# Altium project MPAXFC_00.PrjPcb (part 1 of 2)
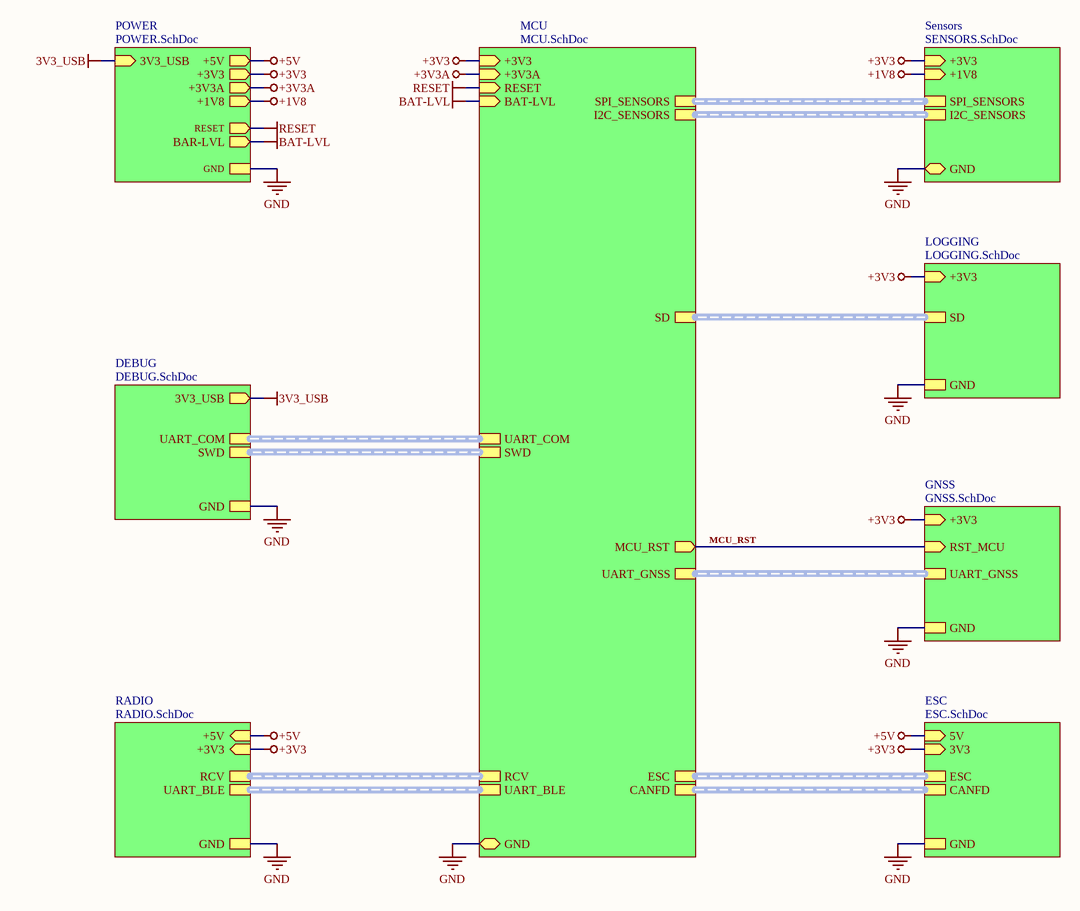
[diagram p0: MAIN.SchDoc]
9 sheets, 103 parts. Net scope: hierarchical (ports join the sheet entries above them; power ports are global).
Sheets:
  MAIN.SchDoc
    MCU = MCU.SchDoc
    Sensors = SENSORS.SchDoc
    LOGGING = LOGGING.SchDoc
    GNSS = GNSS.SchDoc
    POWER = POWER.SchDoc
    DEBUG = DEBUG.SchDoc
    ESC = ESC.SchDoc
    RADIO = RADIO.SchDoc

## Sheet MAIN.SchDoc
size A3

### Sub-sheets
DEBUG = DEBUG.SchDoc: GND, 3V3_USB (out), UART_COM (harness UART_COM), SWD (harness SWD)
ESC = ESC.SchDoc: 5V (in), 3V3 (in), GND, ESC (harness ESC), CANFD (harness CANFD)
GNSS = GNSS.SchDoc: +3V3 (in), GND, RST_MCU (in), UART_GNSS (harness UART_GNSS)
LOGGING = LOGGING.SchDoc: +3V3 (in), GND, SD (harness SD)
MCU = MCU.SchDoc: +3V3 (in), GND (bidir), +3V3A (in), RESET (in), SWD (harness SWD), UART_GNSS (harness UART_GNSS), UART_COM (harness UART_COM), RCV (harness RCV), ESC (harness ESC), CANFD (harness CANFD), SD (harness SD), SPI_SENSORS (harness SPI_SENSORS), I2C_SENSORS (harness I2C_SENSORS), BAT-LVL (in), MCU_RST (out), UART_BLE (harness UART_BLE)
POWER = POWER.SchDoc: +5V (out), +3V3 (out), +1V8 (out), GND, RESET (out), +3V3A (out), 3V3_USB (in), BAR-LVL (out)
RADIO = RADIO.SchDoc: +5V (in), +3V3 (in), GND, RCV (harness RCV), UART_BLE (harness UART_BLE)
Sensors = SENSORS.SchDoc: +3V3 (in), GND (bidir), +1V8 (in), SPI_SENSORS (harness SPI_SENSORS), I2C_SENSORS (harness I2C_SENSORS)

### Nets
3V3_USB: sheet POWER/3V3_USB, sheet DEBUG/3V3_USB  [project net +3V3_USB]
+1V8: sheet Sensors/+1V8, sheet POWER/+1V8
+3V3: sheet MCU/+3V3, sheet Sensors/+3V3, sheet LOGGING/+3V3, sheet GNSS/+3V3, sheet POWER/+3V3, sheet ESC/3V3, sheet RADIO/+3V3
+3V3A: sheet MCU/+3V3A, sheet POWER/+3V3A
+5V: sheet POWER/+5V, sheet ESC/5V, sheet RADIO/+5V
BAT-LVL: sheet MCU/BAT-LVL, sheet POWER/BAR-LVL  [project net ADC1_INP2]
GND: sheet MCU/GND, sheet Sensors/GND, sheet LOGGING/GND, sheet GNSS/GND, sheet POWER/GND, sheet DEBUG/GND, sheet ESC/GND, sheet RADIO/GND
MCU_RST: sheet MCU/MCU_RST, sheet GNSS/RST_MCU
RESET: sheet MCU/RESET, sheet POWER/RESET  [project net NRST]

### Buses and harness runs
harness sheet DEBUG/SWD = sheet MCU/SWD
harness sheet DEBUG/UART_COM = sheet MCU/UART_COM
harness sheet ESC/CANFD = sheet MCU/CANFD
harness sheet ESC/ESC = sheet MCU/ESC
harness sheet GNSS/UART_GNSS = sheet MCU/UART_GNSS
harness sheet LOGGING/SD = sheet MCU/SD
harness sheet MCU/I2C_SENSORS = sheet Sensors/I2C_SENSORS
harness sheet MCU/RCV = sheet RADIO/RCV
harness sheet MCU/SPI_SENSORS = sheet Sensors/SPI_SENSORS
harness sheet MCU/UART_BLE = sheet RADIO/UART_BLE

## Sheet MCU.SchDoc
size A3
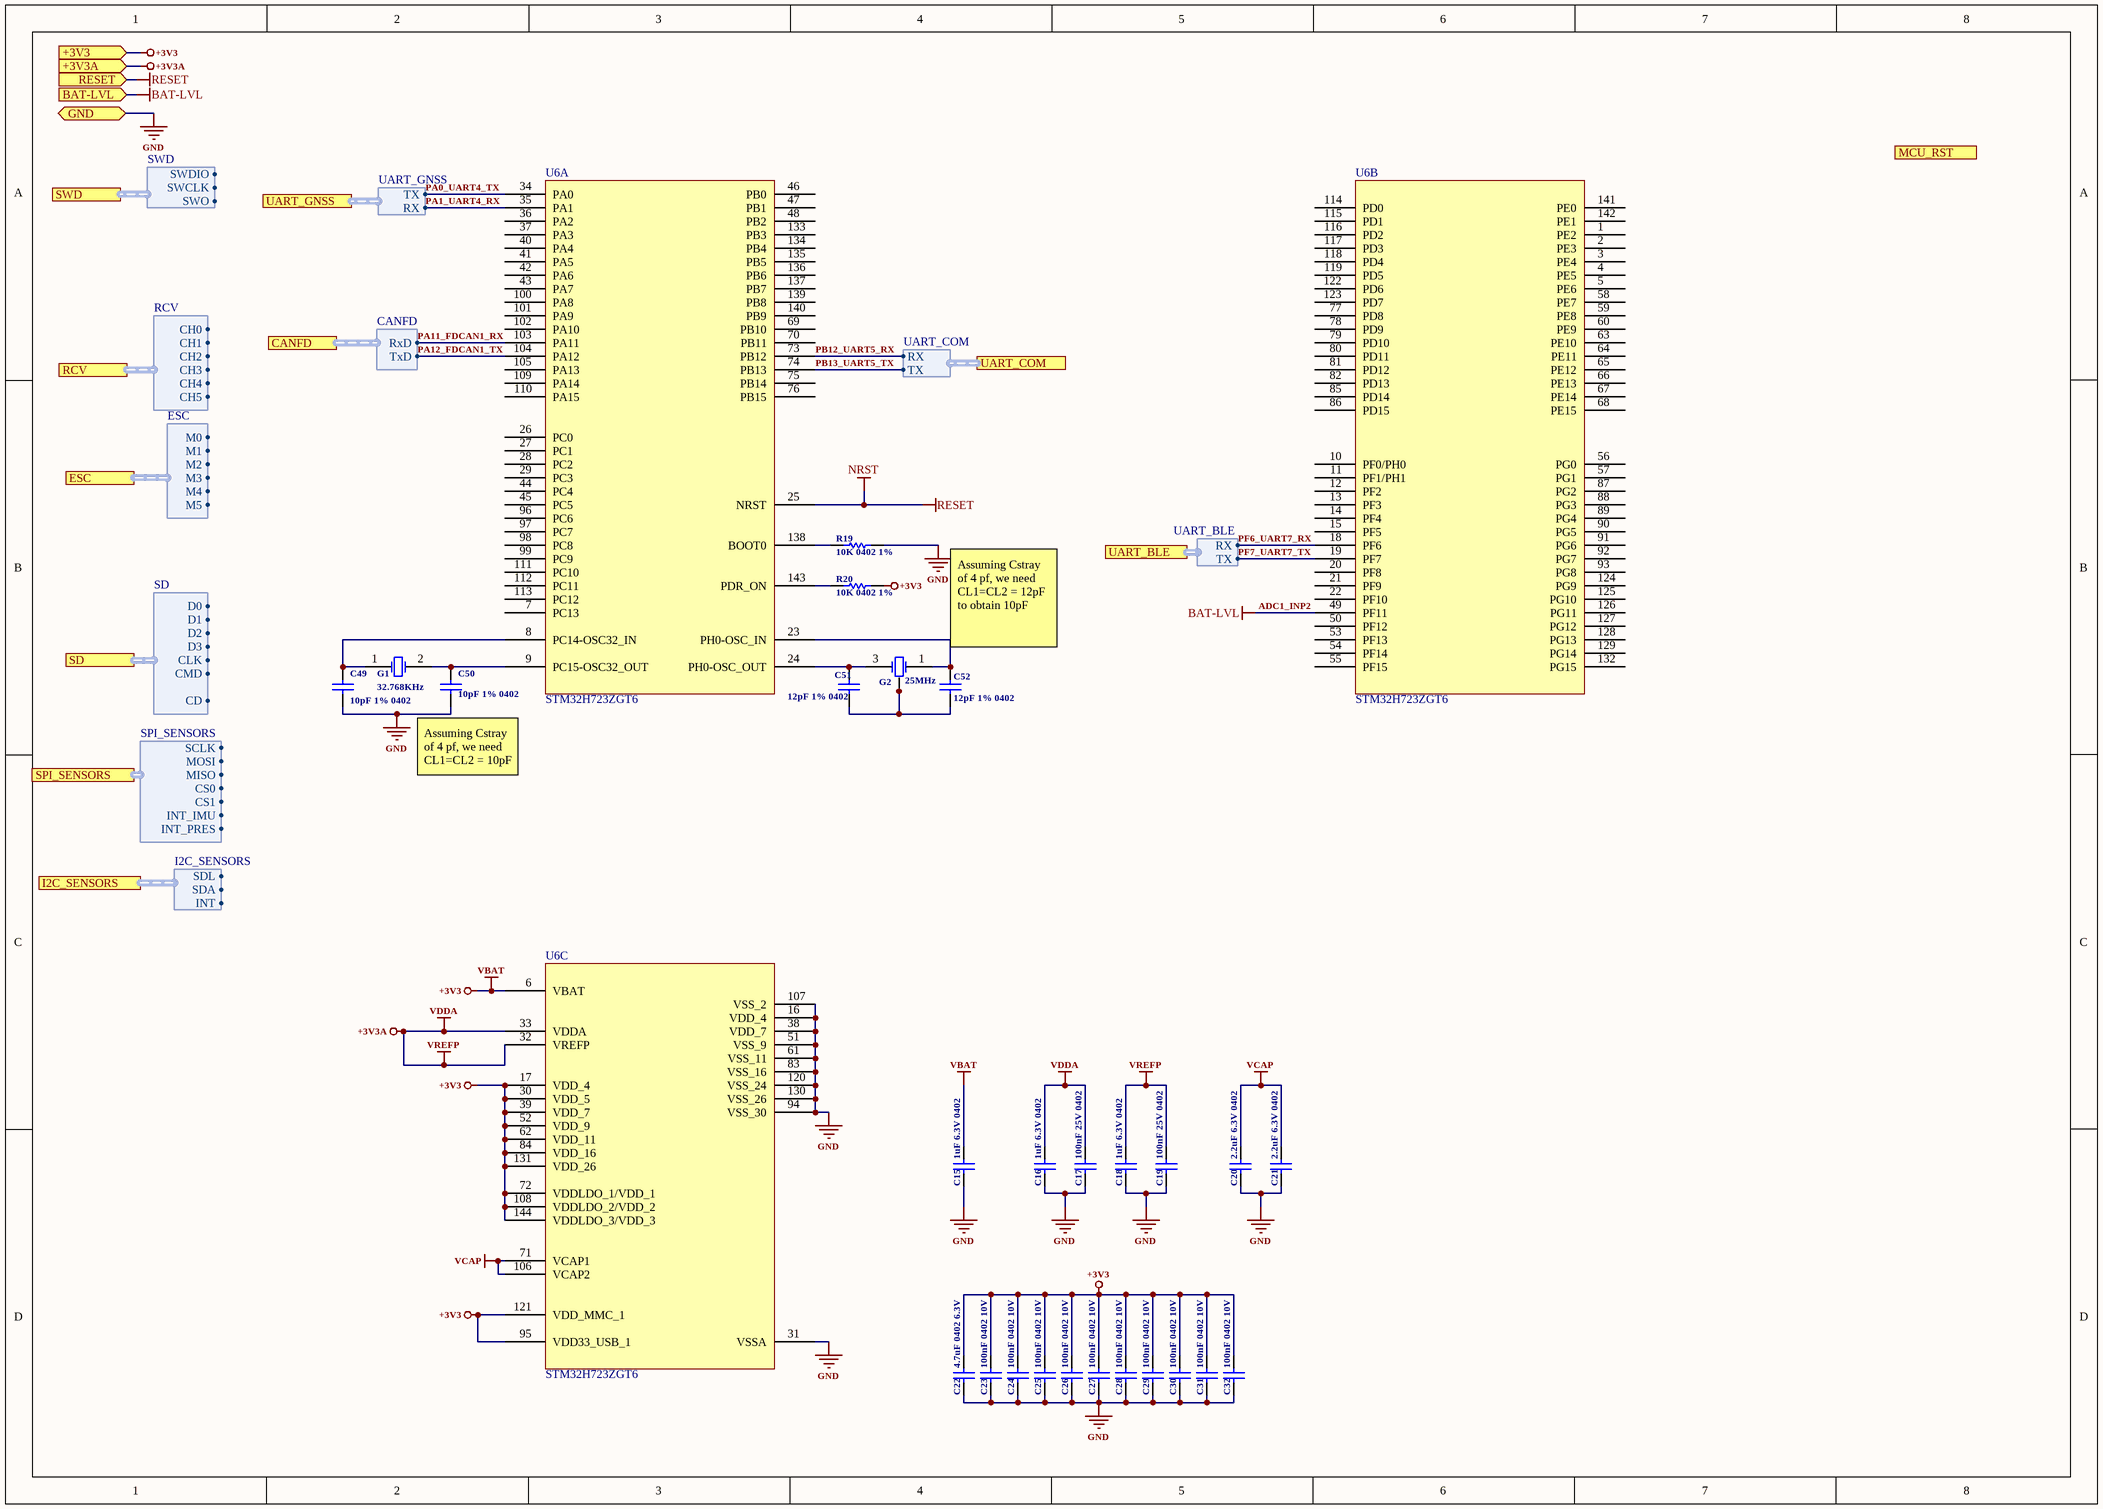
[diagram p1: MCU.SchDoc]

### Parts
C15  1uF 6.3V 0402
C16  1uF 6.3V 0402
C17  100nF 25V 0402
C18  1uF 6.3V 0402
C19  100nF 25V 0402
C20  2.2uF 6.3V 0402
C21  2.2uF 6.3V 0402
C22  4.7uF 0402 6.3V
C23  100nF 0402 10V
C24  100nF 0402 10V
C25  100nF 0402 10V
C26  100nF 0402 10V
C27  100nF 0402 10V
C28  100nF 0402 10V
C29  100nF 0402 10V
C30  100nF 0402 10V
C31  100nF 0402 10V
C32  100nF 0402 10V
C49  10pF 1% 0402
C50  10pF 1% 0402
C51  12pF 1% 0402
C52  12pF 1% 0402
G1  32.768KHz
G2  25MHz
R19  10K 0402 1%  [Resistor_0402]
R20  10K 0402 1%  [Resistor_0402]
U6  STM32H723ZGT6  (parts A,B,C of 3)

### Ports
+3V3 (in), +3V3A (in), BAT-LVL (in), CANFD (harness CANFD), ESC (harness ESC), GND (bidir), I2C_SENSORS (harness I2C_SENSORS), MCU_RST (out), RCV (harness RCV), RESET (in), SD (harness SD), SPI_SENSORS (harness SPI_SENSORS), SWD (harness SWD), UART_BLE (harness UART_BLE), UART_COM (harness UART_COM), UART_GNSS (harness UART_GNSS)

### Harnesses
SWD: SWDIO, SWCLK, SWO
UART_GNSS: TX, RX
UART_COM: TX, RX
RCV: CH0, CH1, CH2, CH3, CH4, CH5
ESC: M0, M1, M2, M3, M4, M5
CANFD: TxD, RxD
SD: CD, CMD, CLK, D0, D1, D2, D3
SPI_SENSORS: SCLK, MOSI, MISO, CS0, CS1, INT_IMU, INT_PRES
I2C_SENSORS: SDL, SDA, INT
UART_BLE: RX, TX

### Nets
+3V3: C15.2 C22.2 C23.2 C24.2 C25.2 C26.2 C27.2 C28.2 C29.2 C30.2 C31.2 C32.2 R20.2 U6.6(VBAT) U6.17(VDD_4) U6.30(VDD_5) U6.39(VDD_7) U6.52(VDD_9) U6.62(VDD_11) U6.72(VDDLDO_1/VDD_1) U6.84(VDD_16) U6.95(VDD33_USB_1) U6.108(VDDLDO_2/VDD_2) U6.121(VDD_MMC_1) U6.131(VDD_26) U6.144(VDDLDO_3/VDD_3) ; port +3V3  [also labelled VBAT]
+3V3A: C16.2 C17.2 C18.2 C19.2 U6.32(VREFP) U6.33(VDDA) ; port +3V3A  [also labelled VDDA, VREFP]
ADC1_INP2: U6.49(PF11) ; port BAT-LVL  [also labelled BAT-LVL]
GND: C15.1 C16.1 C17.1 C18.1 C19.1 C20.1 C21.1 C22.1 C23.1 C24.1 C25.1 C26.1 C27.1 C28.1 C29.1 C30.1 C31.1 C32.1 C49.1 C50.1 R19.2 U6.16(VDD_4) U6.31(VSSA) U6.38(VDD_7) U6.51(VSS_9) U6.61(VSS_11) U6.83(VSS_16) U6.94(VSS_30) U6.107(VSS_2) U6.120(VSS_24) U6.130(VSS_26) ; port GND
NRST: U6.25(NRST) ; port RESET  [also labelled RESET]
VCAP: C20.2 C21.2 U6.71(VCAP1) U6.106(VCAP2)
PA0_UART4_TX: U6.34(PA0) ; port UART_GNSS.TX
PA1_UART4_RX: U6.35(PA1) ; port UART_GNSS.RX
PA11_FDCAN1_RX: U6.103(PA11) ; port CANFD.RxD
PA12_FDCAN1_TX: U6.104(PA12) ; port CANFD.TxD
PB12_UART5_RX: U6.73(PB12) ; port UART_COM.RX
PB13_UART5_TX: U6.74(PB13) ; port UART_COM.TX
PF6_UART7_RX: U6.18(PF6) ; port UART_BLE.RX
PF7_UART7_TX: U6.19(PF7) ; port UART_BLE.TX
NetC49_2: C49.2 G1.1(OSC1) U6.8(PC14-OSC32_IN)
NetC50_2: C50.2 G1.2(OSC2) U6.9(PC15-OSC32_OUT)
NetC51_1: C51.1 C52.1 G2.2(GND) G2.4(GND)
NetC51_2: C51.2 G2.3(OSC1) U6.24(PH0-OSC_OUT)
NetC52_2: C52.2 G2.1(OSC2) U6.23(PH0-OSC_IN)
NetR19_1: R19.1 U6.138(BOOT0)
NetR20_1: R20.1 U6.143(PDR_ON)

Not connected (* = marked no-connect by the designer): U6 1(PE2) 2(PE3) 3(PE4) 4(PE5) 5(PE6) 7(PC13) 10(PF0/PH0) 11(PF1/PH1) 12(PF2) 13(PF3) 14(PF4) 15(PF5) 20(PF8) 21(PF9) 22(PF10) 26(PC0) 27(PC1) 28(PC2) 29(PC3) 36(PA2) 37(PA3) 40(PA4) 41(PA5) 42(PA6) 43(PA7) 44(PC4) 45(PC5) 46(PB0) 47(PB1) 48(PB2) 50(PF12) 53(PF13) 54(PF14) 55(PF15) 56(PG0) 57(PG1) 58(PE7) 59(PE8) 60(PE9) 63(PE10) 64(PE11) 65(PE12) 66(PE13) 67(PE14) 68(PE15) 69(PB10) 70(PB11) 75(PB14) 76(PB15) 77(PD8) 78(PD9) 79(PD10) 80(PD11) 81(PD12) 82(PD13) 85(PD14) 86(PD15) 87(PG2) 88(PG3) 89(PG4) 90(PG5) 91(PG6) 92(PG7) 93(PG8) 96(PC6) 97(PC7) 98(PC8) 99(PC9) 100(PA8) 101(PA9) 102(PA10) 105(PA13) 109(PA14) 110(PA15) 111(PC10) 112(PC11) 113(PC12) 114(PD0) 115(PD1) 116(PD2) 117(PD3) 118(PD4) 119(PD5) 122(PD6) 123(PD7) 124(PG9) 125(PG10) 126(PG11) 127(PG12) 128(PG13) 129(PG14) 132(PG15) 133(PB3) 134(PB4) 135(PB5) 136(PB6) 137(PB7) 139(PB8) 140(PB9) 141(PE0) 142(PE1)

### Notes on the sheet
- Assuming Cstray of 4 pf, we need CL1=CL2 = 12pF to obtain 10pF
- (near C50) Assuming Cstray of 4 pf, we need CL1=CL2 = 10pF

### Library data of the parts
C15 C16 C18 = CL05A105KQ5NNNC 1uF 0402: SAMSUNG ELECTRO-MECHANICS - CL05A105KQ5NNNC - SMD Multilayer Ceramic Capacitor, 1 µF, 6.3 V, 0402 [1005 Metric], ± 10%, X5R, CL Series; Capacitance: 1000000 pF; Supplier 1: Digi-Key; Manufacturer: Samsung; Manufacturer Part Number: CL05A105KQ5NNNC; Stock 1: 2633061; Pricing 1: 1=0.1, 10=0.019, 50=0.0106, 100=0.0087, 500=0.0062, 1000=0.0049, 2500=0.0044, 5000=0.0041 (USD); Case Size/Dimension: 0402; Dielectric: X5R; Tolerance (%): ±10 %; Rated Voltage: 6.3 V; ComponentLink1URL: http://www.samsungsem.com/kr/support/product-search/mlcc/CL05A105KQ5NNNC.jsp?src-supplier=Digi-Key; ComponentLink1Description: http://www.samsungsem.com/kr/support/product-search/mlcc/CL05A105KQ5NNNC.jsp?src-supplier=Digi-Key; ComponentLink2URL: http://www1.futureelectronics.com/doc/SAMSUNG%20PASSIVE/CL05B104KQ5NNNC.pdf?src-supplier=Future+Electronics; ComponentLink2Description: http://www1.futureelectronics.com/doc/SAMSUNG%20PASSIVE/CL05B104KQ5NNNC.pdf?src-supplier=Future+Electronics; ComponentLink3URL: https://www.verical.com/server-webapp/html/getDatasheet?partID=358391&src-supplier=Verical; ComponentLink3Description: https://www.verical.com/server-webapp/html/getDatasheet?partID=358391&src-supplier=Verical; ComponentLink4URL: https://produktinfo.conrad.com/datenblaetter/450000-474999/459172-da-01-en-VS_KONDENSATOR_0402.pdf?src-supplier=Conrad; ComponentLink4Description: https://produktinfo.conrad.com/datenblaetter/450000-474999/459172-da-01-en-VS_KONDENSATOR_0402.pdf?src-supplier=Conrad; Supplier Part Number 1: 1276-1010-1-ND; Value: 1uF 6.3V 0402
C17 C19 = CL05A104KA5NNNC 100nf 0402: 100nF, 25V, MLCC, 0402; Manufacturer: Samsung; Capacitance: 0.1 µF; Dielectric: X5R; Tolerance (%): ±10 %; Supplier 1: Digi-Key; Manufacturer Part Number: CL05A104KA5NNNC; Stock 1: 8000233; Pricing 1: 1=0.1, 10=0.012, 50=0.0064, 100=0.0053, 500=0.0038, 1000=0.003, 2500=0.0027, 5000=0.0025 (USD); Case Size/Dimension: 0402; Rated Voltage: 25 V; ComponentLink1URL: http://www1.futureelectronics.com/doc/SAMSUNG/CL05A104KA5NNNC.pdf?src-supplier=Future+Electronics; ComponentLink1Description: http://www1.futureelectronics.com/doc/SAMSUNG/CL05A104KA5NNNC.pdf?src-supplier=Future+Electronics; ComponentLink2URL: http://www.samsungsem.com/kr/support/product-search/mlcc/CL05A104KA5NNNC.jsp?src-supplier=Digi-Key; ComponentLink2Description: http://www.samsungsem.com/kr/support/product-search/mlcc/CL05A104KA5NNNC.jsp?src-supplier=Digi-Key; ComponentLink3URL: https://www.distrelec.biz/Web/Downloads/_e/ng/MLCC_CatalogDownload2013_ENG.pdf?mime=application%2Fpdf&src-supplier=Distrelec; ComponentLink3Description: https://www.distrelec.biz/Web/Downloads/_e/ng/MLCC_CatalogDownload2013_ENG.pdf?mime=application%2Fpdf&src-supplier=Distrelec; ComponentLink4URL: https://www.verical.com/server-webapp/html/getDatasheet?partID=357412&src-supplier=Verical; ComponentLink4Description: https://www.verical.com/server-webapp/html/getDatasheet?partID=357412&src-supplier=Verical; Supplier Part Number 1: 1276-1043-1-ND; Value: 100nF 25V 0402
C20 C21 = CL05A225MQ5NNNC 2.2uF 0402: CAP CER 2.2UF 6.3V X5R 0402; Designator: C?; Supplier 1: Digi-Key; Supplier Part Number 1: 1276-1469-1-ND; Value: 2.2uF 6.3V 0402
C22 = GRM155R60J475ME87D 4.7uF 0402 6.3V: MURATA - GRM155R60J475ME87D - SMD Multilayer Ceramic Capacitor, 4.7 µF, 6.3 V, 0402 [1005 Metric], ± 20%, X5R, GRM Series; Rad Hard: No; Product Depth: 0.5 mm; Voltage: 6.3 Vdc; Product Length: 1 mm; Supplier 1: Digi-Key; Manufacturer: Murata; Manufacturer Part Number: GRM155R60J475ME87D; Stock 1: 78795; Pricing 1: 1=0.14, 10=0.101, 50=0.0572, 100=0.0474, 500=0.0332, 1000=0.0275, 2500=0.0256, 5000=0.0234 (USD); Packaging: Tape & Reel; Package/Case: 0402; Mounting: Surface Mount; Capacitance Value: 4.7 uF; Tolerance: 20 %; Dielectric: X5R; Operating Temperature: -55 to 85 °C; Construction: Flat; Product Height: 0.5 mm; Category: Capacitor Ceramic Multilayer; ComponentLink1URL: https://www.murata.com/~/media/webrenewal/support/library/catalog/products/capacitor/mlcc/c02e.ashx?la=en-us&src-supplier=Digi-Key; ComponentLink1Description: https://www.murata.com/~/media/webrenewal/support/library/catalog/products/capacitor/mlcc/c02e.ashx?la=en-us&src-supplier=Digi-Key; ComponentLink2URL: http://components.arrow.com/part/dataview/47740841S8828489N2606?src-supplier=Arrow+Electronics; ComponentLink2Description: http://components.arrow.com/part/dataview/47740841S8828489N2606?src-supplier=Arrow+Electronics; Supplier Part Number 1: 490-5408-1-ND; Value: 4.7uF 0402 6.3V
C23-C32 = CL05A104KP5NNNC 100nF 0402 10V: Cap Ceramic 0.1uF 10V X5R 10% SMD 0402 85C Paper T/R; Manufacturer: Samsung; Capacitance: 100000 pF; Supplier 1: Digi-Key; Manufacturer Part Number: CL05A104KP5NNNC; Stock 1: 5595689; Pricing 1: 1=0.1, 10=0.021, 50=0.0116, 100=0.0094, 500=0.0067, 1000=0.0053, 2500=0.0048, 5000=0.0044 (USD); Case Size/Dimension: 0402; Dielectric: X5R; Tolerance (%): ±10 %; Rated Voltage: 10 V; ComponentLink1URL: https://www.distrelec.biz/Web/Downloads/_e/ng/MLCC_CatalogDownload2013_ENG.pdf?mime=application%2Fpdf&src-supplier=Distrelec; ComponentLink1Description: https://www.distrelec.biz/Web/Downloads/_e/ng/MLCC_CatalogDownload2013_ENG.pdf?mime=application%2Fpdf&src-supplier=Distrelec; ComponentLink2URL: https://media.digikey.com/pdf/Data%20Sheets/Samsung%20PDFs/CL_Series_MLCC_ds.pdf?src-supplier=Digi-Key; ComponentLink2Description: https://media.digikey.com/pdf/Data%20Sheets/Samsung%20PDFs/CL_Series_MLCC_ds.pdf?src-supplier=Digi-Key; ComponentLink3URL: http://www1.futureelectronics.com/doc/SAMSUNG%20PASSIVE/CL05B104KQ5NNNC.pdf?src-supplier=Future+Electronics; ComponentLink3Description: http://www1.futureelectronics.com/doc/SAMSUNG%20PASSIVE/CL05B104KQ5NNNC.pdf?src-supplier=Future+Electronics; ComponentLink4URL: https://www.verical.com/server-webapp/html/getDatasheet?partID=358611&src-supplier=Verical; ComponentLink4Description: https://www.verical.com/server-webapp/html/getDatasheet?partID=358611&src-supplier=Verical; Supplier Part Number 1: 1276-1022-1-ND; Value: 100nF 0402 10V
C49 C50 = CC0402FRNPO9BN100: 10 pF ±1% 50V Ceramic Capacitor C0G, NP0 0402 (1005 Metric); Supplier 1: Digi-Key; Supplier Part Number 1: 311-1640-1-ND; Value: 10pF 1% 0402
C51 C52 = CC0402FRNPO9BN120: 12 pF ±1% 50V Ceramic Capacitor C0G, NP0 0402 (1005 Metric); Supplier 1: Digi-Key; Supplier Part Number 1: 311-1641-1-ND; Value: 12pF 1% 0402
G1 = ECS-.327-9-34B-C-TR: 32.768 kHz ±10ppm Crystal 9pF 70 kOhms 2-SMD, No Lead; Value: 32.768KHz; Supplier 1: Digi-Key; Supplier Part Number 1: XC1949CT-ND
G2 = ECS-250-10-36B2-CTN-TR: 25 MHz ±10ppm Crystal 10pF 50 Ohms 4-SMD, No Lead; Supplier 1: Digi-Key; Supplier Part Number 1: 50-ECS-250-10-36B2-CTN-TRCT-ND; Value: 25MHz
R19 R20 = AC0402FR-0710KL 10K 0402 1%: RES SMD 10K OHM 1% 1/16W 0402; Manufacturer: Yageo; Resistance: 10 kOhms; Power Rating: 62.5 mW (1/16 W); Voltage Rating: 50 V; Temperature Coefficient: 100 PPM / C; Supplier 1: Digi-Key; Manufacturer Part Number: AC0402FR-0710KL; Stock 1: 1375478; Pricing 1: 1=0.1, 10=0.021, 100=0.0086, 1000=0.0039, 2500=0.0033, 5000=0.0028 (USD); Termination Style: SMD/SMT; Product: Thick Film Resistors SMD; Tolerance: 1 %; Case Code - in: 0402; Case Code - mm: 1005; Series: AC; Operating Temperature Range: - 55 C to + 155 C; Packaging: Reel; ComponentLink1URL: http://www.mouser.com/ds/2/447/yageodocoutput-1111992.pdf?src-supplier=Mouser; ComponentLink1Description: http://www.mouser.com/ds/2/447/yageodocoutput-1111992.pdf?src-supplier=Mouser; Supplier Part Number 1: YAG3436CT-ND; Value: 10K 0402 1%
U6 = STM32H723ZGT6: Supplier 1: Digi-Key; Supplier Part Number 1: 497-STM32H723ZGT6-ND

## Sheet SENSORS.SchDoc
size A4
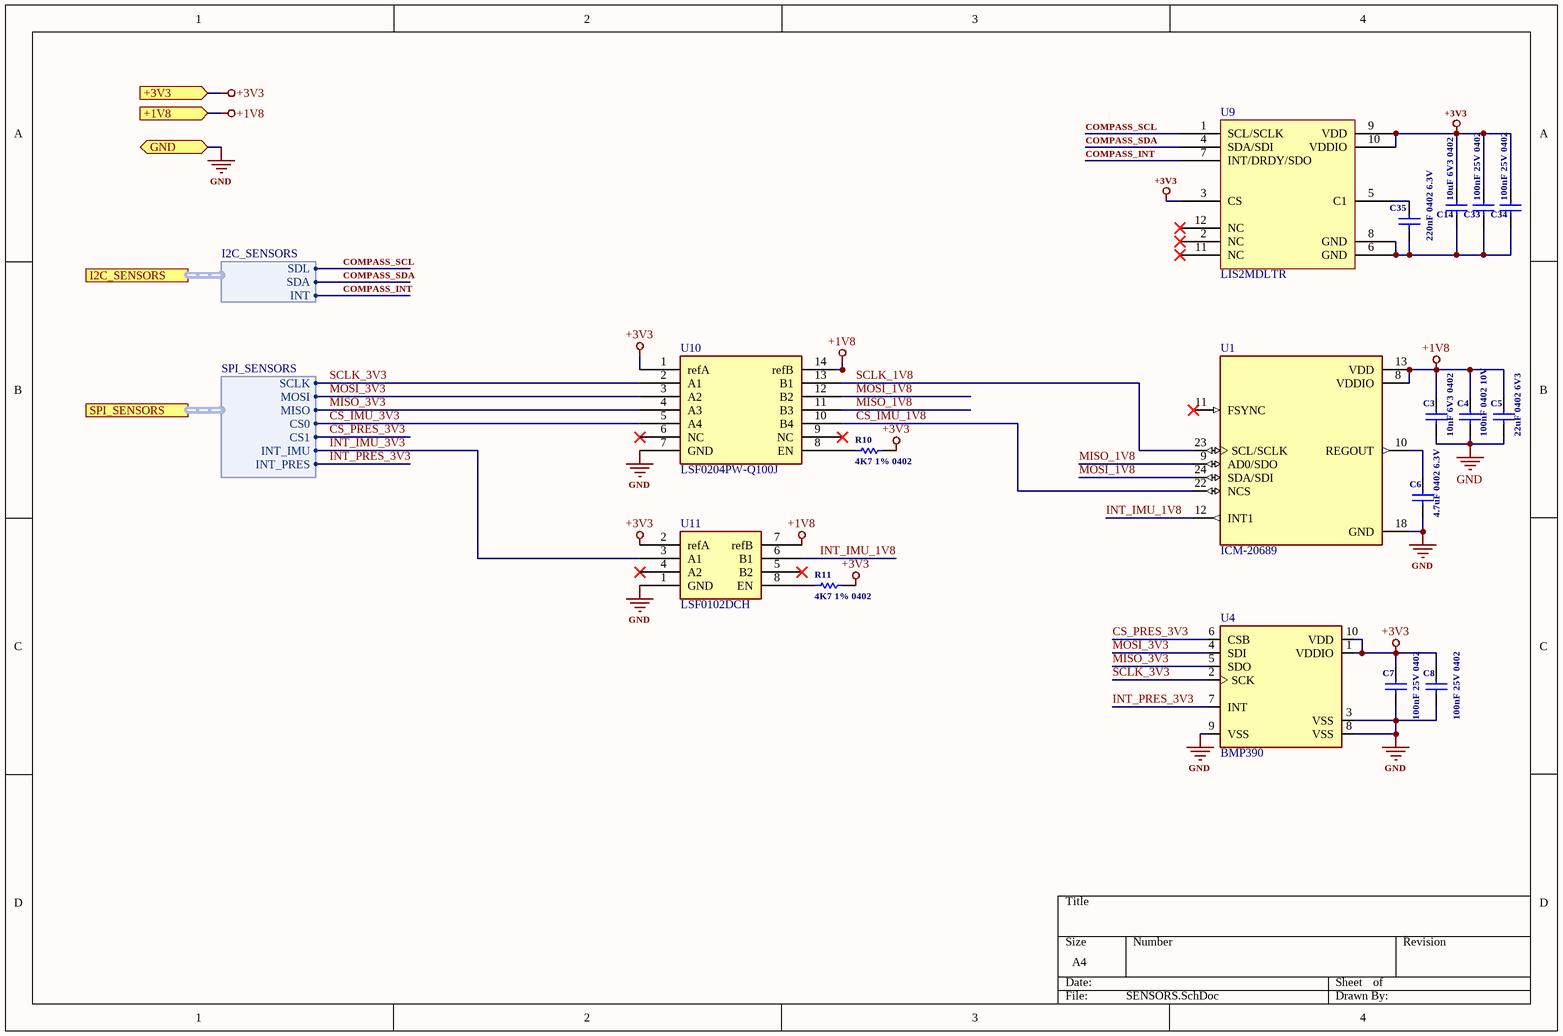
[diagram p2: SENSORS.SchDoc]

### Parts
C3  10nF 6V3 0402
C4  100nF 0402 10V
C5  22uF 0402 6V3
C6  4.7uF 0402 6.3V
C7  100nF 25V 0402
C8  100nF 25V 0402
C14  10uF 6V3 0402
C33  100nF 25V 0402
C34  100nF 25V 0402
C35  220nF 0402 6.3V
R10  4K7 1% 0402  [Resistor_0402]
R11  4K7 1% 0402  [Resistor_0402]
U1  ICM-20689
U4  BMP390
U9  LIS2MDLTR
U10  LSF0204PW-Q100J  [TSOP65P640X110-14N]
U11  LSF0102DCH

### Ports
+1V8 (in), +3V3 (in), GND (bidir), I2C_SENSORS (harness I2C_SENSORS), SPI_SENSORS (harness SPI_SENSORS)

### Harnesses
SPI_SENSORS: SCLK, MOSI, MISO, CS0, CS1, INT_IMU, INT_PRES
I2C_SENSORS: SDL, SDA, INT

### Nets
+1V8: C3.2 C4.2 C5.2 U1.8(VDDIO) U1.13(VDD) U10.14(refB) U11.7(refB) ; port +1V8
+3V3: C7.2 C8.2 C14.2 C33.2 C34.2 R10.2 R11.2 U4.1(VDDIO) U4.10(VDD) U9.3(CS) U9.9(VDD) U9.10(VDDIO) U10.1(refA) U11.2(refA) ; port +3V3
GND: C3.1 C4.1 C5.1 C6.1 C7.1 C8.1 U1.18(GND) U4.3(VSS) U4.8(VSS) U4.9(VSS) U10.7(GND) U11.1(GND) ; port GND
COMPASS_INT: U9.7(INT/DRDY/SDO) ; port I2C_SENSORS.INT
COMPASS_SCL: U9.1(SCL/SCLK) ; port I2C_SENSORS.SDL
COMPASS_SDA: U9.4(SDA/SDI) ; port I2C_SENSORS.SDA
CS_IMU_1V8: U1.22(NCS) U10.10(B4)
CS_IMU_3V3: U10.5(A4) ; port SPI_SENSORS.CS0
CS_PRES_3V3: U4.6(CSB) ; port SPI_SENSORS.CS1
INT_IMU_1V8: U1.12(INT1) U11.6(B1)
INT_IMU_3V3: U11.3(A1) ; port SPI_SENSORS.INT_IMU
INT_PRES_3V3: U4.7(INT) ; port SPI_SENSORS.INT_PRES
MISO_1V8: U1.9(AD0/SDO) U10.11(B3)
MISO_3V3: U4.5(SDO) U10.4(A3) ; port SPI_SENSORS.MISO
MOSI_1V8: U1.24(SDA/SDI) U10.12(B2)
MOSI_3V3: U4.4(SDI) U10.3(A2) ; port SPI_SENSORS.MOSI
SCLK_1V8: U1.23(SCL/SCLK) U10.13(B1)
SCLK_3V3: U4.2(SCK) U10.2(A1) ; port SPI_SENSORS.SCLK
NetC6_2: C6.2 U1.10(REGOUT)
NetC14_1: C14.1 C33.1 C34.1 C35.2 U9.6(GND) U9.8(GND)
NetC35_1: C35.1 U9.5(C1)
NetR10_1: R10.1 U10.8(EN)
NetR11_1: R11.1 U11.8(EN)

Not connected (* = marked no-connect by the designer): U1 11(FSYNC)*; U9 2(NC)* 11(NC)* 12(NC)*; U10 6(NC)* 9(NC)*; U11 4(A2)* 5(B2)*

### Library data of the parts
C3 = 04026C103KAT2A  10nF 6.3V: Supplier 1: Digi-Key; Supplier Part Number 1: 478-04026C103KAT2ACT-ND; Value: 10nF 6V3 0402
C4 = CL05A104KP5NNNC 100nF 0402 10V: as C23 on sheet MCU; Supplier 1: Digi-Key; Manufacturer Part Number: CL05A104KP5NNNC; Stock 1: 5595689; Pricing 1: 1=0.1, 10=0.021, 50=0.0116, 100=0.0094, 500=0.0067, 1000=0.0053, 2500=0.0048, 5000=0.0044 (USD); Case Size/Dimension: 0402; Dielectric: X5R; Tolerance (%): ±10 %; Rated Voltage: 10 V; ComponentLink1URL: https://www.distrelec.biz/Web/Downloads/_e/ng/MLCC_CatalogDownload2013_ENG.pdf?mime=application%2Fpdf&src-supplier=Distrelec; ComponentLink1Description: https://www.distrelec.biz/Web/Downloads/_e/ng/MLCC_CatalogDownload2013_ENG.pdf?mime=application%2Fpdf&src-supplier=Distrelec; ComponentLink2URL: https://media.digikey.com/pdf/Data%20Sheets/Samsung%20PDFs/CL_Series_MLCC_ds.pdf?src-supplier=Digi-Key; ComponentLink2Description: https://media.digikey.com/pdf/Data%20Sheets/Samsung%20PDFs/CL_Series_MLCC_ds.pdf?src-supplier=Digi-Key; ComponentLink3URL: http://www1.futureelectronics.com/doc/SAMSUNG%20PASSIVE/CL05B104KQ5NNNC.pdf?src-supplier=Future+Electronics; ComponentLink3Description: http://www1.futureelectronics.com/doc/SAMSUNG%20PASSIVE/CL05B104KQ5NNNC.pdf?src-supplier=Future+Electronics; ComponentLink4URL: https://www.verical.com/server-webapp/html/getDatasheet?partID=358611&src-supplier=Verical; ComponentLink4Description: https://www.verical.com/server-webapp/html/getDatasheet?partID=358611&src-supplier=Verical; Supplier Part Number 1: 1276-1022-1-ND; Value: 100nF 0402 10V
C5 = CL05A226MQ5N6J8 22uF 0402 6V3: CL05 Series 22 uF 6.3 V ±20% Tolerance X5R SMT Multilayer Ceramic Capacitor; Manufacturer: Samsung; Categories: Capacitors; Capacitance: 22µF; Voltage - Rated: 6.3V; Supplier 1: Digi-Key; Manufacturer Part Number: CL05A226MQ5N6J8; Stock 1: 135434; Pricing 1: 1=0.53, 10=0.366, 50=0.2564, 100=0.2197, 500=0.1648, 1000=0.1392, 2500=0.1318 (USD); Series: CL; Packaging: Tape & Reel (TR); Part Status: Active; Tolerance: ±20%; Temperature Coefficient: X5R; Operating Temperature: -55°C ~ 85°C; Features: -; Ratings: -; Applications: General Purpose; Failure Rate: -; Mounting Type: Surface Mount, MLCC; Package / Case: 0402 (1005 Metric); Size / Dimension: 0.039 L x 0.020 W (1.00mm x 0.50mm); Height - Seated (Max): -; Thickness (Max): 0.030 (0.75mm); Lead Spacing: -; Lead Style: -; ComponentLink1URL: http://www.samsungsem.com/kr/support/library/product-catalog/mlcc.jsp?src-supplier=Digi-Key; ComponentLink1Description: http://www.samsungsem.com/kr/support/library/product-catalog/mlcc.jsp?src-supplier=Digi-Key; Supplier Part Number 1: 1276-7090-1-ND; Value: 22uF 0402 6V3
C6 = GRM155R60J475ME87D 4.7uF 0402 6.3V: as C22 on sheet MCU; Supplier 1: Digi-Key; Manufacturer: Murata; Manufacturer Part Number: GRM155R60J475ME87D; Stock 1: 78795; Pricing 1: 1=0.14, 10=0.101, 50=0.0572, 100=0.0474, 500=0.0332, 1000=0.0275, 2500=0.0256, 5000=0.0234 (USD); Packaging: Tape & Reel; Package/Case: 0402; Mounting: Surface Mount; Capacitance Value: 4.7 uF; Tolerance: 20 %; Dielectric: X5R; Operating Temperature: -55 to 85 °C; Construction: Flat; Product Height: 0.5 mm; Category: Capacitor Ceramic Multilayer; ComponentLink1URL: https://www.murata.com/~/media/webrenewal/support/library/catalog/products/capacitor/mlcc/c02e.ashx?la=en-us&src-supplier=Digi-Key; ComponentLink1Description: https://www.murata.com/~/media/webrenewal/support/library/catalog/products/capacitor/mlcc/c02e.ashx?la=en-us&src-supplier=Digi-Key; ComponentLink2URL: http://components.arrow.com/part/dataview/47740841S8828489N2606?src-supplier=Arrow+Electronics; ComponentLink2Description: http://components.arrow.com/part/dataview/47740841S8828489N2606?src-supplier=Arrow+Electronics; Supplier Part Number 1: 490-5408-1-ND; Value: 4.7uF 0402 6.3V
C7 C8 C33 C34 = CL05A104KA5NNNC 100nf 0402: as C17 on sheet MCU; Supplier 1: Digi-Key; Manufacturer Part Number: CL05A104KA5NNNC; Stock 1: 8000233; Pricing 1: 1=0.1, 10=0.012, 50=0.0064, 100=0.0053, 500=0.0038, 1000=0.003, 2500=0.0027, 5000=0.0025 (USD); Case Size/Dimension: 0402; Rated Voltage: 25 V; ComponentLink1URL: http://www1.futureelectronics.com/doc/SAMSUNG/CL05A104KA5NNNC.pdf?src-supplier=Future+Electronics; ComponentLink1Description: http://www1.futureelectronics.com/doc/SAMSUNG/CL05A104KA5NNNC.pdf?src-supplier=Future+Electronics; ComponentLink2URL: http://www.samsungsem.com/kr/support/product-search/mlcc/CL05A104KA5NNNC.jsp?src-supplier=Digi-Key; ComponentLink2Description: http://www.samsungsem.com/kr/support/product-search/mlcc/CL05A104KA5NNNC.jsp?src-supplier=Digi-Key; ComponentLink3URL: https://www.distrelec.biz/Web/Downloads/_e/ng/MLCC_CatalogDownload2013_ENG.pdf?mime=application%2Fpdf&src-supplier=Distrelec; ComponentLink3Description: https://www.distrelec.biz/Web/Downloads/_e/ng/MLCC_CatalogDownload2013_ENG.pdf?mime=application%2Fpdf&src-supplier=Distrelec; ComponentLink4URL: https://www.verical.com/server-webapp/html/getDatasheet?partID=357412&src-supplier=Verical; ComponentLink4Description: https://www.verical.com/server-webapp/html/getDatasheet?partID=357412&src-supplier=Verical; Supplier Part Number 1: 1276-1043-1-ND; Value: 100nF 25V 0402
C14 = CL05A106MP5NUNC 10uF 0402: CL05A106MP5NUNC CAP CER 10UF 10V X5R 0402; Value: 10uF 6V3 0402; Supplier 1: Digi-Key; Supplier Part Number 1: 1276-1450-1-ND
C35 = CL05B224KO5NNNC 220nF 0402 6.3V: SAMSUNG ELECTRO-MECHANICS - CL05B224KO5NNNC - SMD Multilayer Ceramic Capacitor, 0.22 µF, 16 V, 0402 [1005 Metric], ± 10%, X7R, CL Series; Rated Voltage: 16 V; Supplier 1: Digi-Key; Manufacturer: Samsung; Manufacturer Part Number: CL05B224KO5NNNC; Stock 1: 1886603; Pricing 1: 1=0.1, 10=0.033, 50=0.0182, 100=0.0149, 500=0.0106, 1000=0.0084, 2500=0.0076, 5000=0.007 (USD); Capacitance: 220 nF; Case Size/Dimension: 0402; Dielectric: X7R; Tolerance (%): ±10 %; ComponentLink1URL: http://www.samsungsem.com/kr/support/product-search/mlcc/CL05B224KO5NNNC.jsp?src-supplier=Digi-Key; ComponentLink1Description: http://www.samsungsem.com/kr/support/product-search/mlcc/CL05B224KO5NNNC.jsp?src-supplier=Digi-Key; ComponentLink2URL: http://www1.futureelectronics.com/doc/SAMSUNG/CL05B224KO5NNNC.pdf?src-supplier=Future+Electronics; ComponentLink2Description: http://www1.futureelectronics.com/doc/SAMSUNG/CL05B224KO5NNNC.pdf?src-supplier=Future+Electronics; ComponentLink3URL: https://www.verical.com/server-webapp/html/getDatasheet?partID=358459&src-supplier=Verical; ComponentLink3Description: https://www.verical.com/server-webapp/html/getDatasheet?partID=358459&src-supplier=Verical; Supplier Part Number 1: 1276-1176-1-ND; Value: 220nF 0402 6.3V
R10 R11 = AC0402FR-074K7L 4.7K 1% 0402: Thick Film Resistors 1/16W 4.7K ohm 1% AEC-Q200; Manufacturer: Yageo; Resistance: 4.7 kOhms; Power Rating: 62.5 mW (1/16 W); Temperature Coefficient: 100 PPM / C; Voltage Rating: 50 V; Unit Weight: 0.000023 oz; Supplier 1: Digi-Key; Manufacturer Part Number: AC0402FR-074K7L; Stock 1: 3; Pricing 1: 1=0.1, 10=0.021, 100=0.0086, 1000=0.0039, 2500=0.0033, 5000=0.0028 (USD); Product Category: Thick Film Resistors; RoHS: True; Tolerance: 1 %; Case Code - in: 0402; Case Code - mm: 1005; Operating Temperature Range: - 55 C to + 155 C; Series: AC; Brand: Yageo; Height: 0.32 mm; Length: 1 mm; Package / Case: 0402 (1005 metric); Packaging: Reel; Product: Thick Film Resistors SMD; Termination Style: SMD/SMT; Type: Chip Resistor Surface Mount; Width: 0.5 mm; ComponentLink1URL: http://www.mouser.com/ds/2/447/yageodocoutput-1111992.pdf?src-supplier=Mouser; ComponentLink1Description: http://www.mouser.com/ds/2/447/yageodocoutput-1111992.pdf?src-supplier=Mouser; ComponentLink2URL: http://www.yageo.com/documents/recent/PYu-AC_51_RoHS_L_2_revised.pdf?src-supplier=Future+Electronics; ComponentLink2Description: http://www.yageo.com/documents/recent/PYu-AC_51_RoHS_L_2_revised.pdf?src-supplier=Future+Electronics; ComponentLink3URL: http://www.yageo.com/NewPortal/yageodocoutput?fileName=/pdf/R-Chip/PYu-AC_51_RoHS_L_6.pdf&src-supplier=Digi-Key; ComponentLink3Description: http://www.yageo.com/NewPortal/yageodocoutput?fileName=/pdf/R-Chip/PYu-AC_51_RoHS_L_6.pdf&src-supplier=Digi-Key; Supplier Part Number 1: YAG3497CT-ND; Value: 4K7 1% 0402
U1 = ICM-20689: IMU ACCEL/GYRO/COMPI2C/SPI 24QFN; Supplier 1: Digi-Key; Supplier Part Number 1: 1428-1059-6-ND
U10 = LSF0204PW-Q100J: Nivel de voltaje Traductores Bidireccional 1 circuitos 4 canales 120MHz 14-TSSOP; Supplier 1: Digi-Key; Supplier Part Number 1: 1727-LSF0204PW-Q100JCT-ND
U11 = LSF0102DCH: Voltage Level Translator Bidirectional 1 Circuit 2 Channel 100MHz 8-VSSOP; Supplier 1: Digi-Key; Supplier Part Number 1: 1727-LSF0102DCHCT-ND
U4 = BMP390: Supplier 1: Mouser; Supplier Part Number 1: 262-BMP390
U9 = LIS2MDLTR: Supplier 1: Digi-Key; Supplier Part Number 1: 497-17588-1-ND

## Sheet LOGGING.SchDoc
size A4
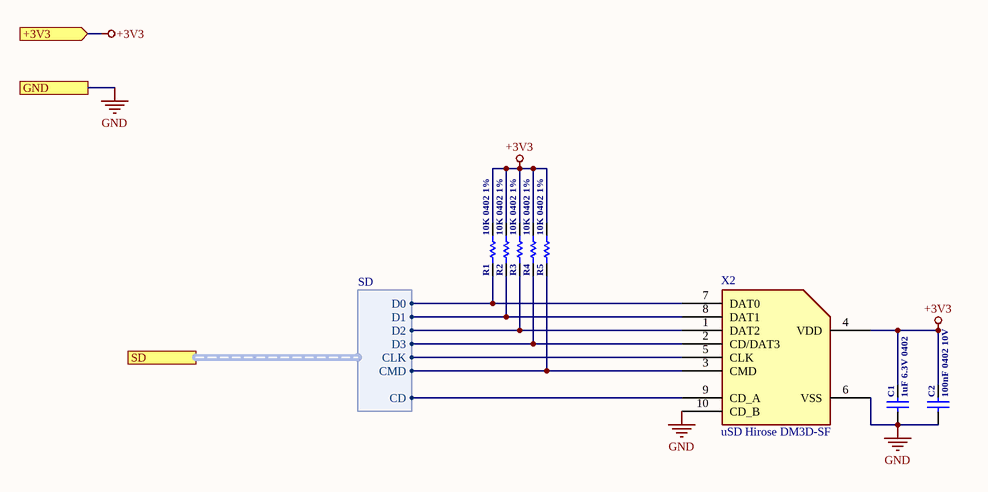
[diagram p3: LOGGING.SchDoc]

### Parts
C1  1uF 6.3V 0402
C2  100nF 0402 10V
R1  10K 0402 1%  [Resistor_0402]
R2  10K 0402 1%  [Resistor_0402]
R3  10K 0402 1%  [Resistor_0402]
R4  10K 0402 1%  [Resistor_0402]
R5  10K 0402 1%  [Resistor_0402]
X2  uSD Hirose DM3D-SF

### Ports
+3V3 (in), GND, SD (harness SD)

### Harnesses
SD: CD, CMD, CLK, D0, D1, D2, D3

### Nets
+3V3: C1.2 C2.2 R1.2 R2.2 R3.2 R4.2 R5.2 X2.4(VDD) ; port +3V3
GND: C1.1 C2.1 X2.6(VSS) X2.10(CD_B) ; port GND
NetR1_1: R1.1 X2.7(DAT0) ; port SD.D0
NetR2_1: R2.1 X2.8(DAT1) ; port SD.D1
NetR3_1: R3.1 X2.1(DAT2) ; port SD.D2
NetR4_1: R4.1 X2.2(CD/DAT3) ; port SD.D3
NetR5_1: R5.1 X2.3(CMD) ; port SD.CMD
NetX2_5: X2.5(CLK) ; port SD.CLK
NetX2_9: X2.9(CD_A) ; port SD.CD

### Library data of the parts
C1 = CL05A105KQ5NNNC 1uF 0402: as C15 on sheet MCU; Supplier 1: Digi-Key; Manufacturer: Samsung; Manufacturer Part Number: CL05A105KQ5NNNC; Stock 1: 2633061; Pricing 1: 1=0.1, 10=0.019, 50=0.0106, 100=0.0087, 500=0.0062, 1000=0.0049, 2500=0.0044, 5000=0.0041 (USD); Case Size/Dimension: 0402; Dielectric: X5R; Tolerance (%): ±10 %; Rated Voltage: 6.3 V; ComponentLink1URL: http://www.samsungsem.com/kr/support/product-search/mlcc/CL05A105KQ5NNNC.jsp?src-supplier=Digi-Key; ComponentLink1Description: http://www.samsungsem.com/kr/support/product-search/mlcc/CL05A105KQ5NNNC.jsp?src-supplier=Digi-Key; ComponentLink2URL: http://www1.futureelectronics.com/doc/SAMSUNG%20PASSIVE/CL05B104KQ5NNNC.pdf?src-supplier=Future+Electronics; ComponentLink2Description: http://www1.futureelectronics.com/doc/SAMSUNG%20PASSIVE/CL05B104KQ5NNNC.pdf?src-supplier=Future+Electronics; ComponentLink3URL: https://www.verical.com/server-webapp/html/getDatasheet?partID=358391&src-supplier=Verical; ComponentLink3Description: https://www.verical.com/server-webapp/html/getDatasheet?partID=358391&src-supplier=Verical; ComponentLink4URL: https://produktinfo.conrad.com/datenblaetter/450000-474999/459172-da-01-en-VS_KONDENSATOR_0402.pdf?src-supplier=Conrad; ComponentLink4Description: https://produktinfo.conrad.com/datenblaetter/450000-474999/459172-da-01-en-VS_KONDENSATOR_0402.pdf?src-supplier=Conrad; Supplier Part Number 1: 1276-1010-1-ND; Value: 1uF 6.3V 0402
C2 = CL05A104KP5NNNC 100nF 0402 10V: as C23 on sheet MCU; Supplier 1: Digi-Key; Manufacturer Part Number: CL05A104KP5NNNC; Stock 1: 5595689; Pricing 1: 1=0.1, 10=0.021, 50=0.0116, 100=0.0094, 500=0.0067, 1000=0.0053, 2500=0.0048, 5000=0.0044 (USD); Case Size/Dimension: 0402; Dielectric: X5R; Tolerance (%): ±10 %; Rated Voltage: 10 V; ComponentLink1URL: https://www.distrelec.biz/Web/Downloads/_e/ng/MLCC_CatalogDownload2013_ENG.pdf?mime=application%2Fpdf&src-supplier=Distrelec; ComponentLink1Description: https://www.distrelec.biz/Web/Downloads/_e/ng/MLCC_CatalogDownload2013_ENG.pdf?mime=application%2Fpdf&src-supplier=Distrelec; ComponentLink2URL: https://media.digikey.com/pdf/Data%20Sheets/Samsung%20PDFs/CL_Series_MLCC_ds.pdf?src-supplier=Digi-Key; ComponentLink2Description: https://media.digikey.com/pdf/Data%20Sheets/Samsung%20PDFs/CL_Series_MLCC_ds.pdf?src-supplier=Digi-Key; ComponentLink3URL: http://www1.futureelectronics.com/doc/SAMSUNG%20PASSIVE/CL05B104KQ5NNNC.pdf?src-supplier=Future+Electronics; ComponentLink3Description: http://www1.futureelectronics.com/doc/SAMSUNG%20PASSIVE/CL05B104KQ5NNNC.pdf?src-supplier=Future+Electronics; ComponentLink4URL: https://www.verical.com/server-webapp/html/getDatasheet?partID=358611&src-supplier=Verical; ComponentLink4Description: https://www.verical.com/server-webapp/html/getDatasheet?partID=358611&src-supplier=Verical; Supplier Part Number 1: 1276-1022-1-ND; Value: 100nF 0402 10V
R1-R5 = AC0402FR-0710KL 10K 0402 1%: as R19 on sheet MCU; Supplier 1: Digi-Key; Manufacturer Part Number: AC0402FR-0710KL; Stock 1: 1375478; Pricing 1: 1=0.1, 10=0.021, 100=0.0086, 1000=0.0039, 2500=0.0033, 5000=0.0028 (USD); Termination Style: SMD/SMT; Product: Thick Film Resistors SMD; Tolerance: 1 %; Case Code - in: 0402; Case Code - mm: 1005; Series: AC; Operating Temperature Range: - 55 C to + 155 C; Packaging: Reel; ComponentLink1URL: http://www.mouser.com/ds/2/447/yageodocoutput-1111992.pdf?src-supplier=Mouser; ComponentLink1Description: http://www.mouser.com/ds/2/447/yageodocoutput-1111992.pdf?src-supplier=Mouser; Supplier Part Number 1: YAG3436CT-ND; Value: 10K 0402 1%
X2 = DM3D-SF: HIROSE(HRS) - DM3D-SF - Memory Socket, microSD Series, Memory Socket, 8 Contacts, Copper Alloy, Gold Plated Contacts; Product Training Modules: DM3 Series microSD Card Sockets; Featured Product: dm3d-series; HTML Datasheet: DM3 Series microSD.html; Card Type: Secure Digital - microSD™; Number of Positions: 10 (8 + 2); Connector Type: Connector; Insertion, Removal Method: Push In, Pull Out; Online Catalog: DM3 Series; Other Names: HR1941CT; Supplier 1: Digi-Key; Manufacturer: Hirose; Manufacturer Part Number: DM3D-SF; Stock 1: 0; Pricing 1: 1=1.65, 10=1.495, 25=1.4032, 50=1.342, 100=1.281, 250=1.159, 500=1.0675, 1000=0.915 (USD); Catalog Drawings: DM3D-SF; Standard Package: 1; Category: Connectors, Interconnects; Family: Memory Connectors - PC Card Sockets; Series: DM3; Packaging: Cut Tape (CT); Ejector Side: -; Mounting Type: Surface Mount, Right Angle; Features: Switch; Height Above Board: 0.061" (1.55mm); Mounting Feature: Normal, Standard - Top; Contact Finish: Gold; Contact Finish Thickness: -; ComponentLink1URL: http://www.farnell.com/datasheets/1697167.pdf?src-supplier=Element14; ComponentLink1Description: http://www.farnell.com/datasheets/1697167.pdf?src-supplier=Element14; ComponentLink2URL: http://www.farnell.com/datasheets/1697167.pdf?src-supplier=Farnell; ComponentLink2Description: http://www.farnell.com/datasheets/1697167.pdf?src-supplier=Farnell; ComponentLink3URL: http://uk.rs-online.com/webdocs/0fd1/0900766b80fd13c1.pdf?src-supplier=RSComponents; ComponentLink3Description: http://uk.rs-online.com/webdocs/0fd1/0900766b80fd13c1.pdf?src-supplier=RSComponents; ComponentLink4URL: http://www.hirose.co.jp/cataloge_hp/e60900232.pdf?src-supplier=Avnet; ComponentLink4Description: http://www.hirose.co.jp/cataloge_hp/e60900232.pdf?src-supplier=Avnet; ComponentLink5URL: http://www.hirose.co.jp/cataloge_hp/e60900232.pdf?src-supplier=Future+Electronics; ComponentLink5Description: http://www.hirose.co.jp/cataloge_hp/e60900232.pdf?src-supplier=Future+Electronics; ComponentLink6URL: https://www.verical.com/server-webapp/html/getDatasheet?partID=432464&src-supplier=Verical; ComponentLink6Description: https://www.verical.com/server-webapp/html/getDatasheet?partID=432464&src-supplier=Verical; ComponentLink7URL: https://www.hirose.com/product/en/download_file/key_name/DM3/category/Catalog/doc_file_id/49662/?file_category_id=4&item_id=195&is_series=1&src-supplier=Digi-Key; ComponentLink7Description: https://www.hirose.com/product/en/download_file/key_name/DM3/category/Catalog/doc_file_id/49662/?file_category_id=4&item_id=195&is_series=1&src-supplier=Digi-Key; Supplier Part Number 1: HR1941CT-ND

## Sheet GNSS.SchDoc
size A4
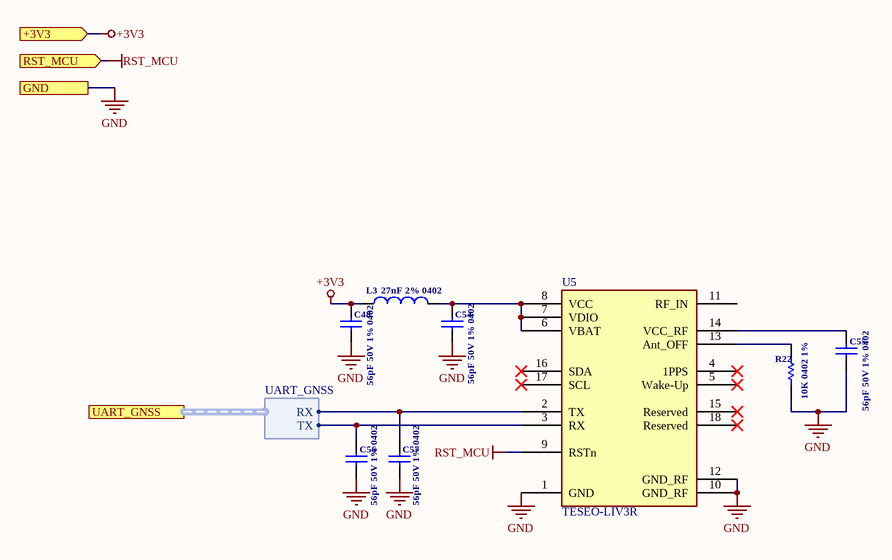
[diagram p4: GNSS.SchDoc]

### Parts
C48  56pF 50V 1% 0402
C54  56pF 50V 1% 0402
C55  56pF 50V 1% 0402
C56  56pF 50V 1% 0402
C57  56pF 50V 1% 0402
L3  27nF 2% 0402
R22  10K 0402 1%  [Resistor_0402]
U5  TESEO-LIV3R

### Ports
+3V3 (in), GND, RST_MCU (in), UART_GNSS (harness UART_GNSS)

### Harnesses
UART_GNSS: RX, TX

### Nets
+3V3: C48.2 L3.1 ; port +3V3
GND: C55.1 C56.1 C57.1 R22.1 U5.1(GND) U5.10(GND_RF) U5.12(GND_RF) ; port GND
RST_MCU: U5.9(RSTn) ; port RST_MCU  [project net MCU_RST]
PA0_UART4_TX: C56.2 U5.3(RX) ; port UART_GNSS.TX
PA1_UART4_RX: C57.2 U5.2(TX) ; port UART_GNSS.RX
NetC54_2: C54.2 L3.2 U5.6(VBAT) U5.7(VDIO) U5.8(VCC)
NetC55_2: C55.2 U5.14(VCC_RF)
NetR22_2: R22.2 U5.13(Ant_OFF)

Not connected (* = marked no-connect by the designer): C48 1; C54 1; U5 4(1PPS)* 5(Wake-Up)* 11(RF_IN) 15(Reserved)* 16(SDA)* 17(SCL)* 18(Reserved)*

### Notes on the sheet
- Labels drawn without touching a wire or pin: GND

### Library data of the parts
C48 C54-C57 = CC0402FRNPO9BN560: 56 pF ±1% 50V Ceramic Capacitor C0G, NP0 0402 (1005 Metric); Supplier 1: Digi-Key; Supplier Part Number 1: 311-3734-1-ND; Value: 56pF 50V 1% 0402
L3 = LQG15HS27NG02D: 27 nH Unshielded Multilayer Inductor 350 mA 460mOhm Max 0402 (1005 Metric) -; Supplier 1: Digi-Key; Value: 27nF 2% 0402; Supplier Part Number 1: 490-LQG15HS27NG02DCT-ND
R22 = AC0402FR-0710KL 10K 0402 1%: as R19 on sheet MCU; Supplier 1: Digi-Key; Manufacturer Part Number: AC0402FR-0710KL; Stock 1: 1375478; Pricing 1: 1=0.1, 10=0.021, 100=0.0086, 1000=0.0039, 2500=0.0033, 5000=0.0028 (USD); Termination Style: SMD/SMT; Product: Thick Film Resistors SMD; Tolerance: 1 %; Case Code - in: 0402; Case Code - mm: 1005; Series: AC; Operating Temperature Range: - 55 C to + 155 C; Packaging: Reel; ComponentLink1URL: http://www.mouser.com/ds/2/447/yageodocoutput-1111992.pdf?src-supplier=Mouser; ComponentLink1Description: http://www.mouser.com/ds/2/447/yageodocoutput-1111992.pdf?src-supplier=Mouser; Supplier Part Number 1: YAG3436CT-ND; Value: 10K 0402 1%
U5 = TESEO-LIV3R: series RF Receiver BeiDou, GLONASS, GNSS, GPS 1.561GHz, 1.575MHz -163dBm - - 18-LCC (9.7x10.1); Supplier 1: Digi-Key; Supplier Part Number 1: 497-19468-1-ND

## Sheet POWER.SchDoc
size A4
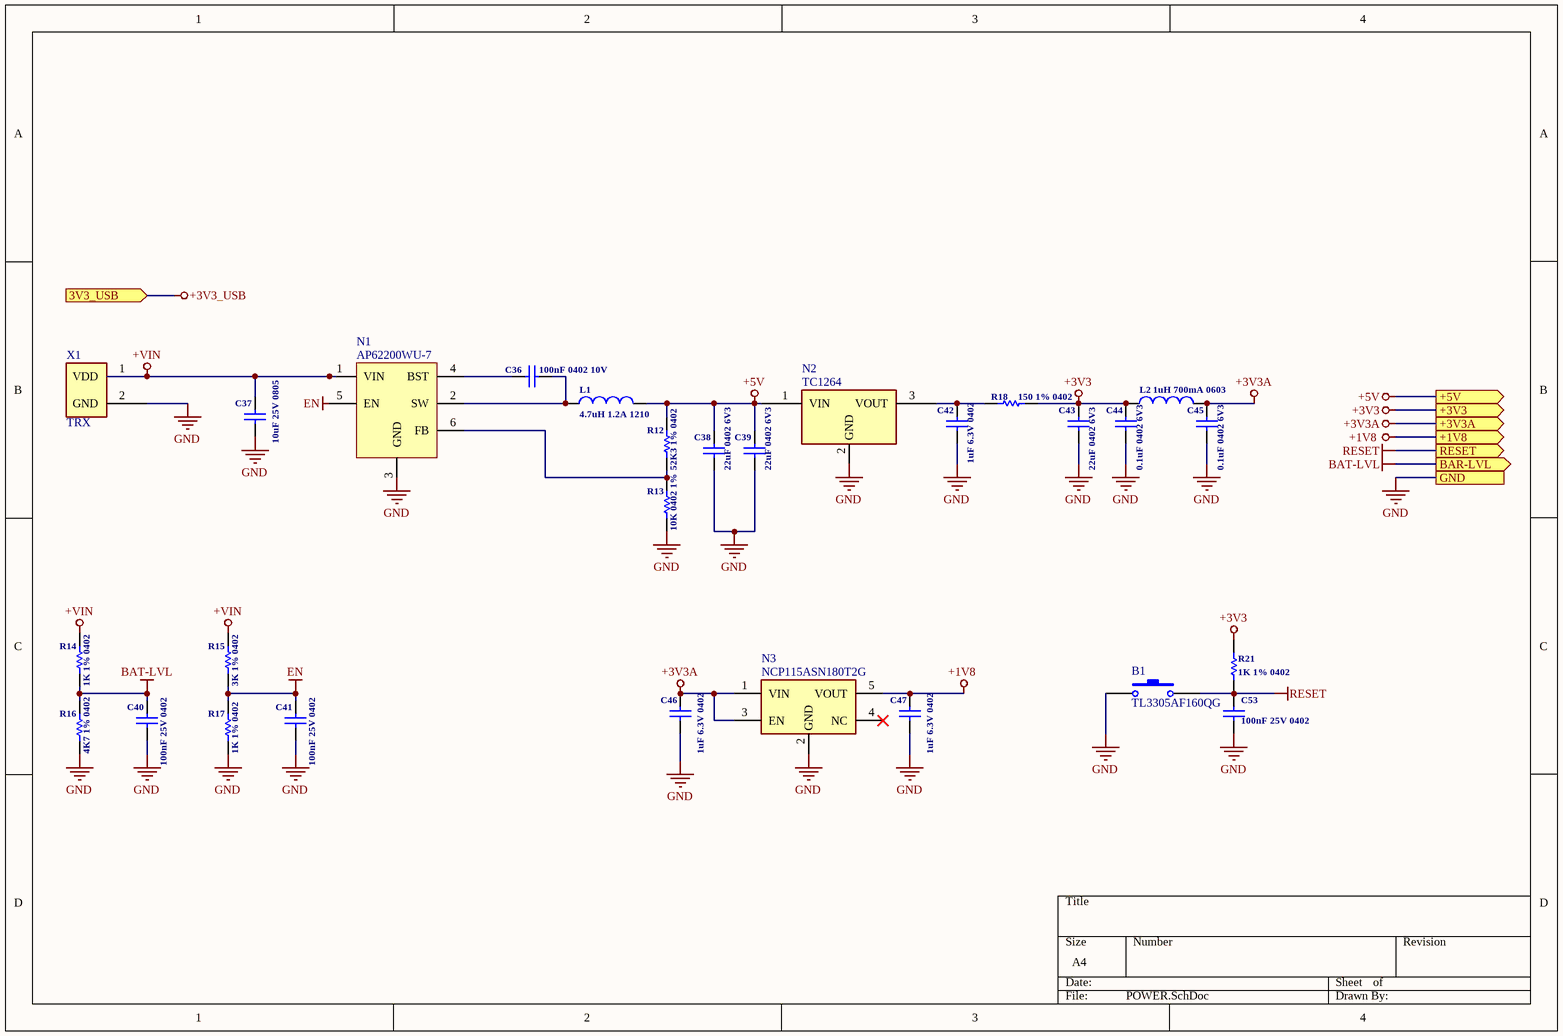
[diagram p5: POWER.SchDoc]

### Parts
B1  TL3305AF160QG
C36  100nF 0402 10V
C37  10uF 25V 0805
C38  22uF 0402 6V3
C39  22uF 0402 6V3
C40  100nF 25V 0402
C41  100nF 25V 0402
C42  1uF 6.3V 0402
C43  22uF 0402 6V3
C44  0.1uF 0402 6V3
C45  0.1uF 0402 6V3
C46  1uF 6.3V 0402
C47  1uF 6.3V 0402
C53  100nF 25V 0402
L1  4.7uH 1.2A 1210
L2  1uH 700mA 0603
N1  AP62200WU-7
N2  TC1264
N3  NCP115ASN180T2G  [NCP115ASN180T2G]
R12  52K3 1% 0402
R13  10K 0402 1%  [Resistor_0402]
R14  1K 1% 0402  [Resistor_0402]
R15  3K 1% 0402
R16  4K7 1% 0402  [Resistor_0402]
R17  1K 1% 0402  [Resistor_0402]
R18  150 1% 0402
R21  1K 1% 0402  [Resistor_0402]
X1  TRX

### Ports
3V3_USB (in), +1V8 (out), +3V3 (out), +3V3A (out), +5V (out), BAR-LVL (out), GND, RESET (out)

### Nets
+1V8 : C47.2 N3.5(VOUT) ; port +1V8  [project net +1V8]
+3V3: C43.2 C44.2 L2.1 R18.2 R21.2 ; port +3V3
+3V3A: C45.2 C46.2 L2.2 N3.1(VIN) N3.3(EN) ; port +3V3A
+5V: C38.2 C39.2 L1.2 N2.1(VIN) R12.2 ; port +5V
+VIN: C37.2 N1.1(VIN) R14.1 R15.2 X1.1(VDD)
BAT-LVL: C40.2 R14.2 R16.2 ; port BAR-LVL  [project net ADC1_INP2]
EN: C41.2 R15.1 R17.1
GND: B1.1 C37.1 C38.1 C39.1 C40.1 C41.1 C42.1 C43.1 C44.1 C45.1 C46.1 C47.1 C53.1 N1.3(GND) N2.2(GND) N3.2(GND) R13.1 R16.1 R17.2 X1.2(GND) ; port GND
RESET: B1.3 C53.2 R21.1 ; port RESET  [project net NRST]
NetC36_1: C36.1 L1.1 N1.2(SW)
NetC36_2: C36.2 N1.4(BST)
NetC42_2: C42.2 N2.3(VOUT) R18.1
NetN1_6: N1.6(FB) R12.1 R13.2

Not connected (* = marked no-connect by the designer): N1 5(EN); N3 4(NC)*

### Notes on the sheet
- Labels drawn without touching a wire or pin: EN

### Library data of the parts
B1 = TL3305AF160QG: Tactile Switch SPST-NO Top Actuated Surface Mount; Supplier 1: Digi-Key; Supplier Part Number 1: EG5350CT-ND
C36 = CL05A104KP5NNNC 100nF 0402 10V: as C23 on sheet MCU; Supplier 1: Digi-Key; Manufacturer Part Number: CL05A104KP5NNNC; Stock 1: 5595689; Pricing 1: 1=0.1, 10=0.021, 50=0.0116, 100=0.0094, 500=0.0067, 1000=0.0053, 2500=0.0048, 5000=0.0044 (USD); Case Size/Dimension: 0402; Dielectric: X5R; Tolerance (%): ±10 %; Rated Voltage: 10 V; ComponentLink1URL: https://www.distrelec.biz/Web/Downloads/_e/ng/MLCC_CatalogDownload2013_ENG.pdf?mime=application%2Fpdf&src-supplier=Distrelec; ComponentLink1Description: https://www.distrelec.biz/Web/Downloads/_e/ng/MLCC_CatalogDownload2013_ENG.pdf?mime=application%2Fpdf&src-supplier=Distrelec; ComponentLink2URL: https://media.digikey.com/pdf/Data%20Sheets/Samsung%20PDFs/CL_Series_MLCC_ds.pdf?src-supplier=Digi-Key; ComponentLink2Description: https://media.digikey.com/pdf/Data%20Sheets/Samsung%20PDFs/CL_Series_MLCC_ds.pdf?src-supplier=Digi-Key; ComponentLink3URL: http://www1.futureelectronics.com/doc/SAMSUNG%20PASSIVE/CL05B104KQ5NNNC.pdf?src-supplier=Future+Electronics; ComponentLink3Description: http://www1.futureelectronics.com/doc/SAMSUNG%20PASSIVE/CL05B104KQ5NNNC.pdf?src-supplier=Future+Electronics; ComponentLink4URL: https://www.verical.com/server-webapp/html/getDatasheet?partID=358611&src-supplier=Verical; ComponentLink4Description: https://www.verical.com/server-webapp/html/getDatasheet?partID=358611&src-supplier=Verical; Supplier Part Number 1: 1276-1022-1-ND; Value: 100nF 0402 10V
C37 = CL21A106KAYNNNG 10uF 0805: 10 µF ±10% 25V Ceramic Capacitor X5R 0805 (2012 Metric); Supplier 1: Digi-Key; Supplier Part Number 1: 1276-6454-1-ND; Value: 10uF 25V 0805
C38 C39 C43 = CL05A226MQ5N6J8 22uF 0402 6V3: as C5 on sheet SENSORS; Supplier 1: Digi-Key; Manufacturer Part Number: CL05A226MQ5N6J8; Stock 1: 135434; Pricing 1: 1=0.53, 10=0.366, 50=0.2564, 100=0.2197, 500=0.1648, 1000=0.1392, 2500=0.1318 (USD); Series: CL; Packaging: Tape & Reel (TR); Part Status: Active; Tolerance: ±20%; Temperature Coefficient: X5R; Operating Temperature: -55°C ~ 85°C; Features: -; Ratings: -; Applications: General Purpose; Failure Rate: -; Mounting Type: Surface Mount, MLCC; Package / Case: 0402 (1005 Metric); Size / Dimension: 0.039 L x 0.020 W (1.00mm x 0.50mm); Height - Seated (Max): -; Thickness (Max): 0.030 (0.75mm); Lead Spacing: -; Lead Style: -; ComponentLink1URL: http://www.samsungsem.com/kr/support/library/product-catalog/mlcc.jsp?src-supplier=Digi-Key; ComponentLink1Description: http://www.samsungsem.com/kr/support/library/product-catalog/mlcc.jsp?src-supplier=Digi-Key; Supplier Part Number 1: 1276-7090-1-ND; Value: 22uF 0402 6V3
C40 C41 C53 = CL05A104KA5NNNC 100nf 0402: as C17 on sheet MCU; Supplier 1: Digi-Key; Manufacturer Part Number: CL05A104KA5NNNC; Stock 1: 8000233; Pricing 1: 1=0.1, 10=0.012, 50=0.0064, 100=0.0053, 500=0.0038, 1000=0.003, 2500=0.0027, 5000=0.0025 (USD); Case Size/Dimension: 0402; Rated Voltage: 25 V; ComponentLink1URL: http://www1.futureelectronics.com/doc/SAMSUNG/CL05A104KA5NNNC.pdf?src-supplier=Future+Electronics; ComponentLink1Description: http://www1.futureelectronics.com/doc/SAMSUNG/CL05A104KA5NNNC.pdf?src-supplier=Future+Electronics; ComponentLink2URL: http://www.samsungsem.com/kr/support/product-search/mlcc/CL05A104KA5NNNC.jsp?src-supplier=Digi-Key; ComponentLink2Description: http://www.samsungsem.com/kr/support/product-search/mlcc/CL05A104KA5NNNC.jsp?src-supplier=Digi-Key; ComponentLink3URL: https://www.distrelec.biz/Web/Downloads/_e/ng/MLCC_CatalogDownload2013_ENG.pdf?mime=application%2Fpdf&src-supplier=Distrelec; ComponentLink3Description: https://www.distrelec.biz/Web/Downloads/_e/ng/MLCC_CatalogDownload2013_ENG.pdf?mime=application%2Fpdf&src-supplier=Distrelec; ComponentLink4URL: https://www.verical.com/server-webapp/html/getDatasheet?partID=357412&src-supplier=Verical; ComponentLink4Description: https://www.verical.com/server-webapp/html/getDatasheet?partID=357412&src-supplier=Verical; Supplier Part Number 1: 1276-1043-1-ND; Value: 100nF 25V 0402
C42 C46 C47 = CL05A105KQ5NNNC 1uF 0402: as C15 on sheet MCU; Supplier 1: Digi-Key; Manufacturer: Samsung; Manufacturer Part Number: CL05A105KQ5NNNC; Stock 1: 2633061; Pricing 1: 1=0.1, 10=0.019, 50=0.0106, 100=0.0087, 500=0.0062, 1000=0.0049, 2500=0.0044, 5000=0.0041 (USD); Case Size/Dimension: 0402; Dielectric: X5R; Tolerance (%): ±10 %; Rated Voltage: 6.3 V; ComponentLink1URL: http://www.samsungsem.com/kr/support/product-search/mlcc/CL05A105KQ5NNNC.jsp?src-supplier=Digi-Key; ComponentLink1Description: http://www.samsungsem.com/kr/support/product-search/mlcc/CL05A105KQ5NNNC.jsp?src-supplier=Digi-Key; ComponentLink2URL: http://www1.futureelectronics.com/doc/SAMSUNG%20PASSIVE/CL05B104KQ5NNNC.pdf?src-supplier=Future+Electronics; ComponentLink2Description: http://www1.futureelectronics.com/doc/SAMSUNG%20PASSIVE/CL05B104KQ5NNNC.pdf?src-supplier=Future+Electronics; ComponentLink3URL: https://www.verical.com/server-webapp/html/getDatasheet?partID=358391&src-supplier=Verical; ComponentLink3Description: https://www.verical.com/server-webapp/html/getDatasheet?partID=358391&src-supplier=Verical; ComponentLink4URL: https://produktinfo.conrad.com/datenblaetter/450000-474999/459172-da-01-en-VS_KONDENSATOR_0402.pdf?src-supplier=Conrad; ComponentLink4Description: https://produktinfo.conrad.com/datenblaetter/450000-474999/459172-da-01-en-VS_KONDENSATOR_0402.pdf?src-supplier=Conrad; Supplier Part Number 1: 1276-1010-1-ND; Value: 1uF 6.3V 0402
C44 C45 = CL05B104KQ5NNNC 0.1uF 0402 6V3: 0.1 µF ±10% 6.3V Ceramic Capacitor X7R 0402 (1005 Metric); Supplier 1: Digi-Key; Supplier Part Number 1: 1276-1511-1-ND; Value: 0.1uF 0402 6V3
L1 = 1276AS-H-4R7M=P2: 4.7 µH Shielded Wirewound Inductor 1.2 A 264mOhm Max 1210 (3225 Metric); Supplier 1: Digi-Key; Supplier Part Number 1: 490-10585-1-ND; Value: 4.7uH 1.2A 1210
L2 = MLZ1608N1R0LT000: 1 µH Shielded Multilayer Inductor 700 mA 110mOhm 0603 (1608 Metric); Supplier 1: Digi-Key; Supplier Part Number 1: 445-6753-1-ND; Value: 1uH 700mA 0603
N1 = AP62200WU-7: Buck Switching Regulator IC Positive Adjustable 0.8V 1 Output 2A SOT-23-6 Thin, TSOT-23-6; Supplier 1: Digi-Key; Supplier Part Number 1: 31-AP62200WU-7CT-ND
N2 = TC1264-3.3VDBTR: Linear Voltage Regulator IC Positive Fixed 1 Output 800mA SOT-223-3; Supplier 1: Digi-Key; Supplier Part Number 1: TC1264-3.3VDBCT-ND
R12 = RT0402FRE0752K3L 52K3 1% 0402: RES SMD 52.3K OHM 1% 1/16W 0402; Supplier 1: Digi-Key; Supplier Part Number 1: 13-RT0402FRE0752K3LCT-ND; Value: 52K3 1% 0402
R13 = AC0402FR-0710KL 10K 0402 1%: as R19 on sheet MCU; Supplier 1: Digi-Key; Manufacturer Part Number: AC0402FR-0710KL; Stock 1: 1375478; Pricing 1: 1=0.1, 10=0.021, 100=0.0086, 1000=0.0039, 2500=0.0033, 5000=0.0028 (USD); Termination Style: SMD/SMT; Product: Thick Film Resistors SMD; Tolerance: 1 %; Case Code - in: 0402; Case Code - mm: 1005; Series: AC; Operating Temperature Range: - 55 C to + 155 C; Packaging: Reel; ComponentLink1URL: http://www.mouser.com/ds/2/447/yageodocoutput-1111992.pdf?src-supplier=Mouser; ComponentLink1Description: http://www.mouser.com/ds/2/447/yageodocoutput-1111992.pdf?src-supplier=Mouser; Supplier Part Number 1: YAG3436CT-ND; Value: 10K 0402 1%
R14 R17 R21 = PFR05S-102-FNH 1K 1% 0402: Res SMD 1 Kohm 1% 1/16W 0402; Manufacturer: Cyntec; Supplier 1: Digi-Key; Manufacturer Part Number: PFR05S-102-FNH; Stock 1: 811154; Pricing 1: 1=0.1, 10=0.014, 100=0.0056, 1000=0.0025, 2500=0.0022, 5000=0.0018 (USD); Supplier Part Number 1: 2037-PFR05S-102-FNHCT-ND; Value: 1K 1% 0402
R15 = RMCF0402FT3K00 3K 0402 1%: 3 kOhms ±1% 0.063W, 1/16W Chip Resistor 0402 (1005 Metric) Automotive AEC-Q200 Thick Film; Supplier 1: Digi-Key; Supplier Part Number 1: RMCF0402FT3K00CT-ND; Value: 3K 1% 0402
R16 = AC0402FR-074K7L 4.7K 1% 0402: as R10 on sheet SENSORS; Supplier 1: Digi-Key; Manufacturer Part Number: AC0402FR-074K7L; Stock 1: 3; Pricing 1: 1=0.1, 10=0.021, 100=0.0086, 1000=0.0039, 2500=0.0033, 5000=0.0028 (USD); Product Category: Thick Film Resistors; RoHS: True; Tolerance: 1 %; Case Code - in: 0402; Case Code - mm: 1005; Operating Temperature Range: - 55 C to + 155 C; Series: AC; Brand: Yageo; Height: 0.32 mm; Length: 1 mm; Package / Case: 0402 (1005 metric); Packaging: Reel; Product: Thick Film Resistors SMD; Termination Style: SMD/SMT; Type: Chip Resistor Surface Mount; Width: 0.5 mm; ComponentLink1URL: http://www.mouser.com/ds/2/447/yageodocoutput-1111992.pdf?src-supplier=Mouser; ComponentLink1Description: http://www.mouser.com/ds/2/447/yageodocoutput-1111992.pdf?src-supplier=Mouser; ComponentLink2URL: http://www.yageo.com/documents/recent/PYu-AC_51_RoHS_L_2_revised.pdf?src-supplier=Future+Electronics; ComponentLink2Description: http://www.yageo.com/documents/recent/PYu-AC_51_RoHS_L_2_revised.pdf?src-supplier=Future+Electronics; ComponentLink3URL: http://www.yageo.com/NewPortal/yageodocoutput?fileName=/pdf/R-Chip/PYu-AC_51_RoHS_L_6.pdf&src-supplier=Digi-Key; ComponentLink3Description: http://www.yageo.com/NewPortal/yageodocoutput?fileName=/pdf/R-Chip/PYu-AC_51_RoHS_L_6.pdf&src-supplier=Digi-Key; Supplier Part Number 1: YAG3497CT-ND; Value: 4K7 1% 0402
R18 = RMCF0402FT150R 150 1% 0402: 150 Ohms ±1% 0.063W, 1/16W Chip Resistor 0402 (1005 Metric) Automotive AEC-Q200 Thick Film; Supplier 1: Digi-Key; Supplier Part Number 1: RMCF0402FT150RCT-ND; Value: 150 1% 0402
N3 = NCP115ASN180T2G: Supplier 1: Digi-Key; Supplier Part Number 1: NCP115ASN180T2GOSCT-ND